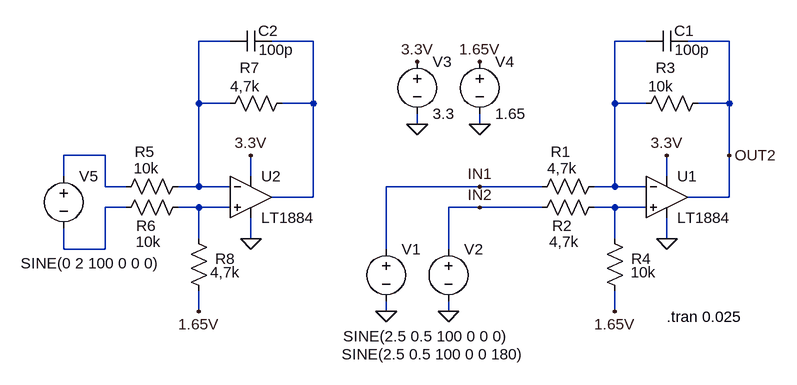
[diagram p0: schematic RES-SIN-COS.asc]
RES-SIN-COS.asc, the LTspice schematic file:
Version 4
SHEET 1 880 680
WIRE -480 -64 -528 -64
WIRE -352 -64 -416 -64
WIRE 160 -64 112 -64
WIRE 288 -64 224 -64
WIRE -528 32 -528 -64
WIRE -480 32 -528 32
WIRE -352 32 -352 -64
WIRE -352 32 -400 32
WIRE 112 32 112 -64
WIRE 160 32 112 32
WIRE 288 32 288 -64
WIRE 288 32 240 32
WIRE -192 64 -192 48
WIRE -96 64 -96 48
WIRE -672 112 -736 112
WIRE 288 112 288 32
WIRE -736 144 -736 112
WIRE -448 144 -448 112
WIRE 192 144 192 112
WIRE -672 160 -672 112
WIRE -640 160 -672 160
WIRE -528 160 -528 32
WIRE -528 160 -560 160
WIRE -480 160 -528 160
WIRE -96 160 -240 160
WIRE 0 160 -96 160
WIRE 112 160 112 32
WIRE 112 160 80 160
WIRE 160 160 112 160
WIRE -352 176 -352 32
WIRE -352 176 -416 176
WIRE 288 176 288 112
WIRE 288 176 224 176
WIRE -640 192 -672 192
WIRE -528 192 -560 192
WIRE -480 192 -528 192
WIRE -96 192 -144 192
WIRE 0 192 -96 192
WIRE 112 192 80 192
WIRE 160 192 112 192
WIRE -528 240 -528 192
WIRE -448 240 -448 208
WIRE 112 240 112 192
WIRE 192 240 192 208
WIRE -736 256 -736 224
WIRE -672 256 -672 192
WIRE -672 256 -736 256
WIRE -240 256 -240 160
WIRE -144 256 -144 192
WIRE -528 352 -528 320
WIRE -240 352 -240 336
WIRE -144 352 -144 336
WIRE 112 352 112 320
FLAG 192 240 0
FLAG 192 112 3.3V
FLAG 112 352 1.65V
FLAG -240 352 0
FLAG -144 352 0
FLAG -192 64 0
FLAG -96 64 0
FLAG -192 -32 3.3V
FLAG -96 -32 1.65V
FLAG -448 240 0
FLAG -448 112 3.3V
FLAG -528 352 1.65V
FLAG -96 160 IN1
FLAG -96 192 IN2
FLAG 288 112 OUT2
SYMBOL res 96 144 R90
WINDOW 0 -22 67 VBottom 2
WINDOW 3 -28 65 VTop 2
SYMATTR InstName R1
SYMATTR Value 4,7k
SYMBOL res 96 176 R90
WINDOW 0 60 65 VBottom 2
WINDOW 3 53 62 VTop 2
SYMATTR InstName R2
SYMATTR Value 4,7k
SYMBOL res 256 16 R90
WINDOW 0 -23 66 VBottom 2
WINDOW 3 -26 73 VTop 2
SYMATTR InstName R3
SYMATTR Value 10k
SYMBOL res 128 336 R180
WINDOW 0 -40 65 Left 2
WINDOW 3 -47 44 Left 2
SYMATTR InstName R4
SYMATTR Value 10k
SYMBOL cap 224 -80 R90
WINDOW 0 16 5 VBottom 2
WINDOW 3 14 -7 VTop 2
SYMATTR InstName C1
SYMATTR Value 100p
SYMBOL voltage -240 240 R0
WINDOW 3 -66 150 Left 2
WINDOW 123 0 0 Left 2
WINDOW 39 0 0 Left 2
SYMATTR Value SINE(2.5 0.5 100 0 0 0)
SYMATTR InstName V1
SYMBOL voltage -144 240 R0
WINDOW 3 -164 178 Left 2
WINDOW 123 0 0 Left 2
WINDOW 39 0 0 Left 2
SYMATTR Value SINE(2.5 0.5 100 0 0 180)
SYMATTR InstName V2
SYMBOL voltage -192 -48 R0
WINDOW 123 0 0 Left 2
WINDOW 39 24 124 Left 2
SYMATTR InstName V3
SYMATTR Value 3.3
SYMBOL voltage -96 -48 R0
WINDOW 123 0 0 Left 2
WINDOW 39 0 0 Left 2
SYMATTR InstName V4
SYMATTR Value 1.65
SYMBOL Opamps\\LT1884 192 112 R0
SYMATTR InstName U1
SYMBOL res -544 144 R90
WINDOW 0 -22 67 VBottom 2
WINDOW 3 -28 65 VTop 2
SYMATTR InstName R5
SYMATTR Value 10k
SYMBOL res -544 176 R90
WINDOW 0 60 65 VBottom 2
WINDOW 3 53 62 VTop 2
SYMATTR InstName R6
SYMATTR Value 10k
SYMBOL res -384 16 R90
WINDOW 0 -23 66 VBottom 2
WINDOW 3 -26 73 VTop 2
SYMATTR InstName R7
SYMATTR Value 4,7k
SYMBOL res -512 336 R180
WINDOW 0 -40 65 Left 2
WINDOW 3 -47 44 Left 2
SYMATTR InstName R8
SYMATTR Value 4,7k
SYMBOL cap -416 -80 R90
WINDOW 0 16 5 VBottom 2
WINDOW 3 14 -7 VTop 2
SYMATTR InstName C2
SYMATTR Value 100p
SYMBOL Opamps\\LT1884 -448 112 R0
SYMATTR InstName U2
SYMBOL voltage -736 128 R0
WINDOW 3 -66 150 Left 2
WINDOW 123 0 0 Left 2
WINDOW 39 0 0 Left 2
SYMATTR Value SINE(0 2 100 0 0 0)
SYMATTR InstName V5
TEXT 192 360 Left 2 !.tran 0.025

The netlist it stands for:
* RES-SIN-COS.asc
R1 N003 IN1 4,7k
R2 N007 IN2 4,7k
R3 OUT2 N003 10k
R4 1.65V N007 10k
C1 OUT2 N003 100p
V1 IN1 0 SINE(2.5 0.5 100 0 0 0)
V2 IN2 0 SINE(2.5 0.5 100 0 0 180)
V3 3.3V 0 3.3
V4 1.65V 0 1.65
XU1 N007 N003 3.3V 0 OUT2 LT1884  ; pins In+ In- V+ V- OUT
R5 N001 N004 10k
R6 N006 N005 10k
R7 N002 N001 4,7k
R8 1.65V N006 4,7k
C2 N002 N001 100p
XU2 N006 N001 3.3V 0 N002 LT1884  ; pins In+ In- V+ V- OUT
V5 N004 N005 SINE(0 2 100 0 0 0)
.tran 0.025
.backanno
.end